# Altium schematic sheet p5_ethernet.SchDoc
size A3; Organization: ORGANIZATION; Address1: ADDRESS 1; Address2: ADDRESS 2; Address3: ADDRESS 3; Address4: ADDRESS 4; Revision: Rev. A; ENG_APP_DATE: --/--/--; DSN_APP_DATE: --/--/--; CHK_APP_DATE: --/--/--
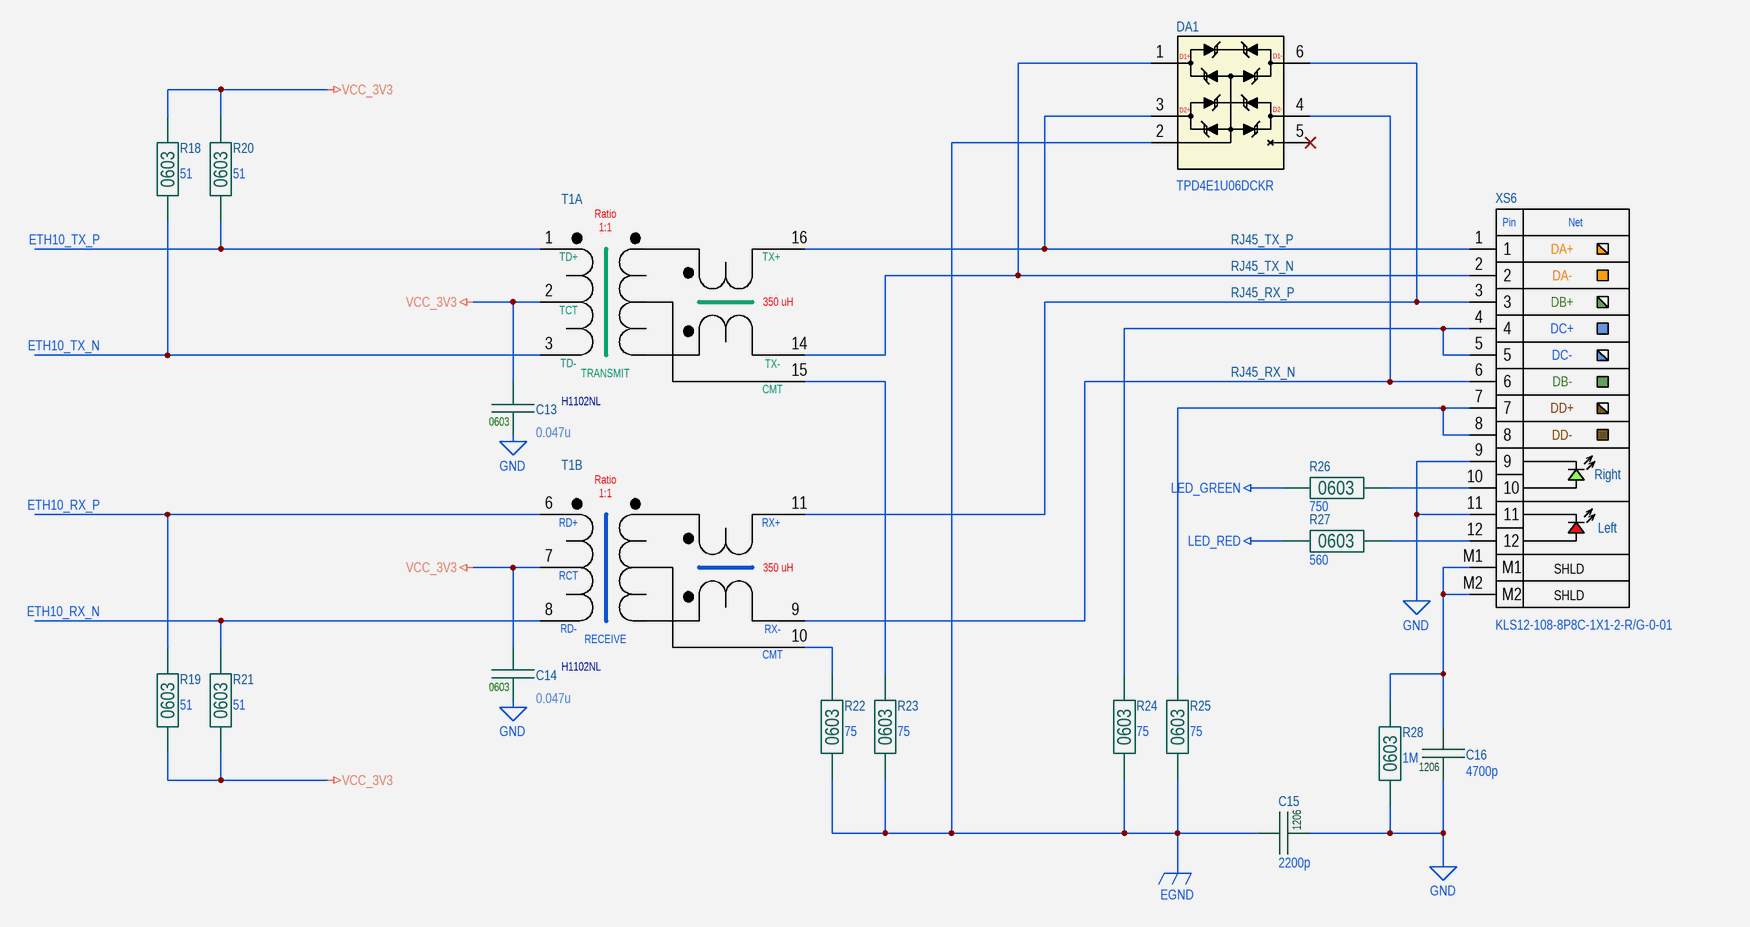
[diagram p0: p5_ethernet.SchDoc]

## Parts
C13  0.047u  Package: 0603  [CAP0603]
C14  0.047u  Package: 0603  [CAP0603]
C15  2200p  Package: 1206  [CAP1206-1.0]
C16  4700p  Package: 1206  [CAP1206-1.4]
DA1  TPD4E1U06DCKR  [SC70-6]
R18  51  Package: 0603  [RES0603B]
R19  51  Package: 0603  [RES0603B]
R20  51  Package: 0603  [RES0603B]
R21  51  Package: 0603  [RES0603B]
R22  75  Package: 0603  [RES0603B]
R23  75  Package: 0603  [RES0603B]
R24  75  Package: 0603  [RES0603B]
R25  75  Package: 0603  [RES0603B]
R26  750  Package: 0603  [RES0603B]
R27  560  Package: 0603  [RES0603B]
R28  1M  Package: 0603  [RES0603B]
T1  H1102NL  [H1102NL]  (parts A,B of 2)
XS6  KLS12-108-8P8C-1X1-2-R/G-0-01  [L-KLS12-108-8P8C_SLOTS]

## Nets
EGND: C15.1 DA1.2(GND) R22.1 R23.1 R24.1 R25.1
GND: C13.1 C14.1 C15.2 C16.1 R28.1 XS6.9 XS6.11
LED_GREEN: R26.2
LED_RED: R27.2
VCC_3V3: C13.2 C14.2 R18.2 R19.1 R20.2 R21.1 T1.2(TCT) T1.7(RCT)
ETH10_RX_N: R21.2 T1.8(RD-)
ETH10_RX_P: R19.2 T1.6(RD+)
ETH10_TX_N: R18.1 T1.3(TD-)
ETH10_TX_P: R20.1 T1.1(TD+)
RJ45_RX_N: DA1.4(D2-) T1.9(RX-) XS6.6
RJ45_RX_P: DA1.6(D1-) T1.11(RX+) XS6.3
RJ45_TX_N: DA1.1(D1+) T1.14(TX-) XS6.2
RJ45_TX_P: DA1.3(D2+) T1.16(TX+) XS6.1
NetC16_2: C16.2 R28.2 XS6.M1 XS6.M2
NetR22_2: R22.2 T1.10(CMTR)
NetR23_2: R23.2 T1.15(CMTT)
NetR24_2: R24.2 XS6.4 XS6.5
NetR25_2: R25.2 XS6.7 XS6.8
NetR26_1: R26.1 XS6.10
NetR27_1: R27.1 XS6.12

Not connected (* = marked no-connect by the designer): DA1 5(NC)*

## Notes on the sheet
- A3
- GitHub <https://github.com/kirra-cat/druino-uno>
- view on
- (in symbol H1102NL, part A) Ratio; 1:1; 350 uH; TRANSMIT; CMT
- (in symbol H1102NL, part B) Ratio; 1:1; 350 uH; RECEIVE; CMT
- (in symbol KLS12-108-8P8C-1X1-2-R/G-0-01) Pin; Net; DA+; DA-; DB+; DC+; DC-; DB-; DD+; DD-; Right; Left; SHLD

## Library data of the parts
C13 C14 = C0603: Capacitors 0603 package case; Part Number: TCC0603X7R473K500CT; Manufacturer: CCTC; Tolerance: ± 10 %; Dielectric: X7R; Voltage: 50V; Value: 0.047u; Value on schem: 0.047u
C15 = C1206: Capacitors 1206 package case; Part Number: TCC1206X7R222K102FT; Manufacturer: CCTC; Tolerance: ± 10 %; Dielectric: X7R; Voltage: 1000V; Value: 2200p; Value on schem: 2200p
C16 = C1206: Capacitors 1206 package case; Part Number: TCC1206X7R472K102FT; Manufacturer: CCTC; Tolerance: ± 10 %; Dielectric: X7R; Voltage: 1000V; Value: 4700p; Value on schem: 4700p
DA1 = TPD4E1U06DCKR: 6 Quad-Channel, High-Speed ESD Protection Device; Manufacturer: Texas Instruments; Part Number: TPD4E1U06DCKR; Package: SC70-6
R18-R21 = R0603: Resistor 0603 package case; Part Number: RC0603FR-0751RL; Manufacturer: Yageo; Tolerance: ± 1 %; Voltage: 100V; Temperature Coefficient: ±100/K; Value: 51; Value on schem: 51
R22-R25 = R0603: Resistor 0603 package case; Part Number: RC0603FR-0775RL; Manufacturer: Yageo; Tolerance: ± 1 %; Voltage: 100V; Temperature Coefficient: ±100/K; Value: 75; Value on schem: 75
R26 = R0603: Resistor 0603 package case; Part Number: RC0603FR-07750RL; Manufacturer: Yageo; Tolerance: ± 1 %; Voltage: 100V; Temperature Coefficient: ±100/K; Value: 750; Value on schem: 750
R27 = R0603: Resistor 0603 package case; Part Number: RC0603FR-07560RL; Manufacturer: Yageo; Tolerance: ± 1 %; Voltage: 100V; Temperature Coefficient: ±100/K; Value: 560; Value on schem: 560
R28 = R0603: Resistor 0603 package case; Part Number: RC0603FR-071ML; Manufacturer: Yageo; Tolerance: ± 1 %; Voltage: 100V; Temperature Coefficient: ±100/K; Value: 1M; Value on schem: 1M
T1 = H1102NL: 10/100BASE-T Ethernet transformer Ratio 1:1 350 uH; Manufacturer: Pulse Electronics; Part Number: H1102NL
XS6 = KLS12-108-8P8C-1X1-2-R/G-0-01: RJ-45; Manufacturer: KLS; Part Number: KLS12-108-8P8C-1X1-2-R/G-0-01; Author: Sklyarov